# EasyEDA Pro project glimmer.epro, schematic Glimmer
Board Name: Glimmer; Create Date: 2026-05-20; Page Name: Glimmer; Project Name: glimmer; Schematic Name: Glimmer; Update Date: 2026-05-23; Company: EasyEDA.com; Page Size: A4; Version: V2.0.1
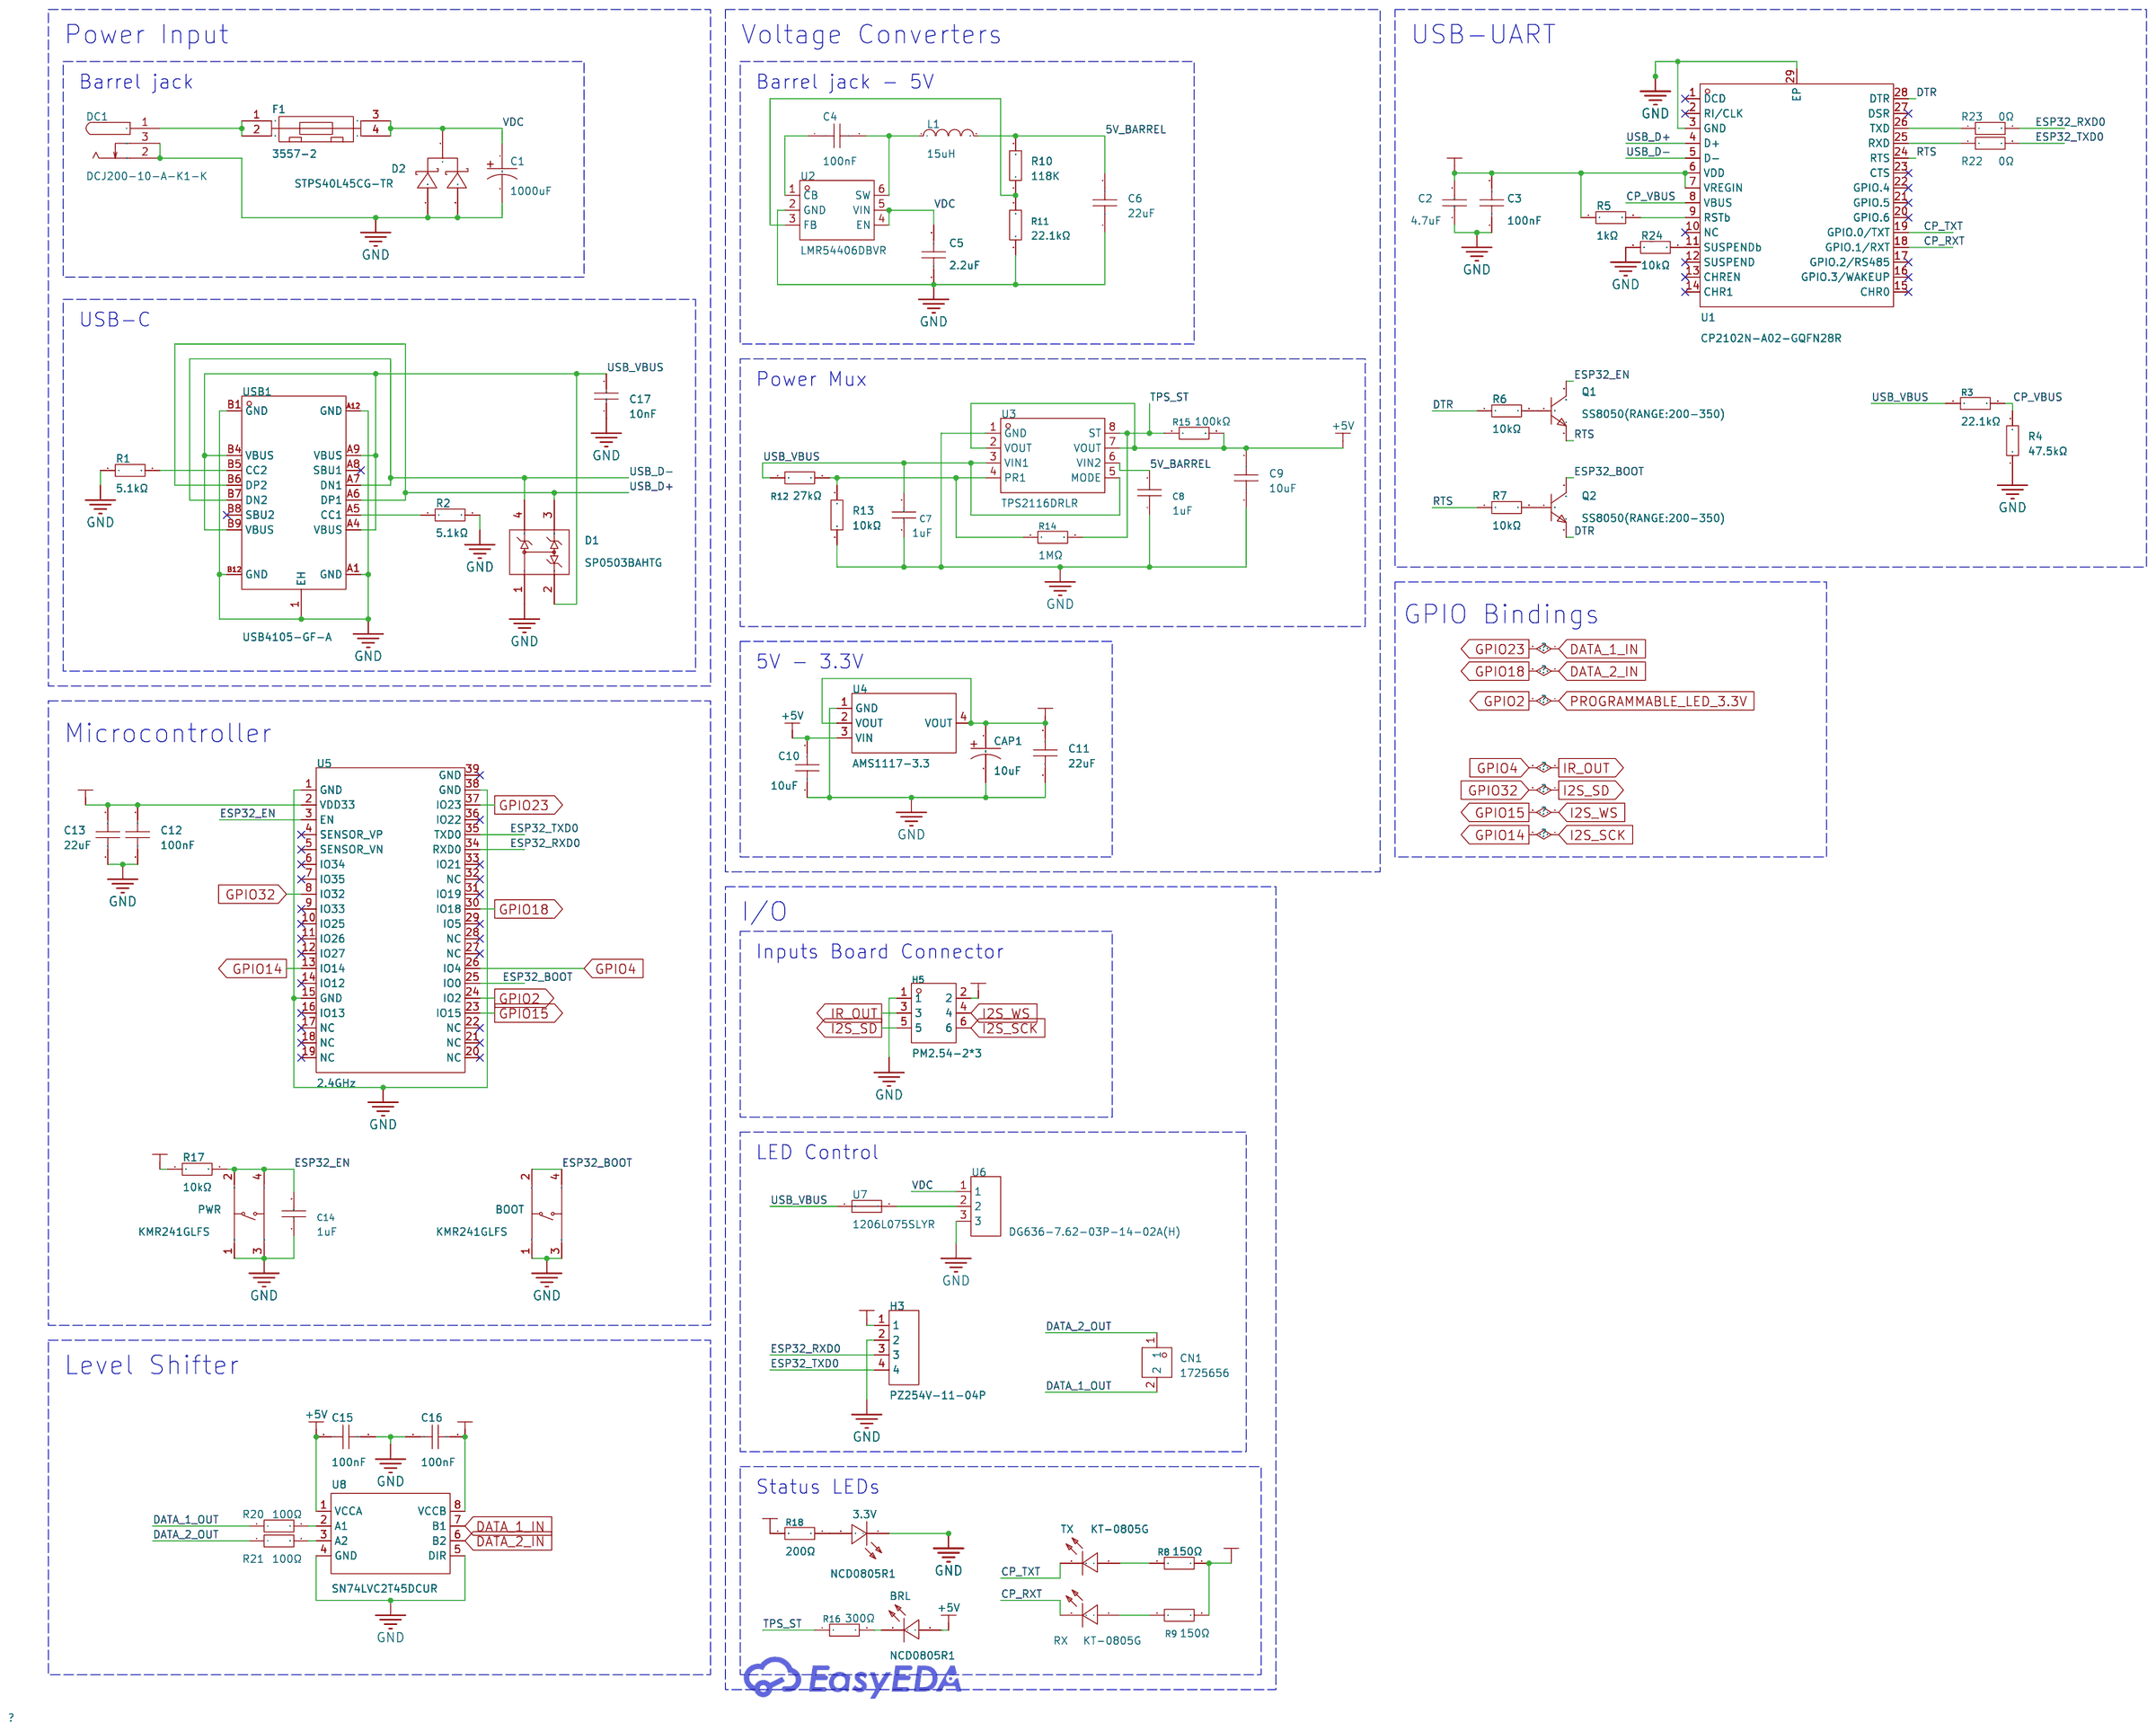
[diagram p0: schematic sheet]

## Parts
3.3V  NCD0805R1  [LED0805-RD]
BOOT  KMR241GLFS  [KEY-SMD_4P-L4.2-W2.8-P1.60-LS4.6]
BRL  NCD0805R1  [LED0805-RD]
C1  1000uF  [CAP-TH_BD18.0-P7.50-D1.2-FD]
C2  4.7uF  [C0805]
C3  100nF  [C0805]
C4  100nF  [C0805]
C5  2.2uF  [C0805]
C6  22uF  [C0805]
C7  1uF  [C0805]
C8  1uF  [C0805]
C9  10uF  [C0805]
C10  10uF  [C0805]
C11  22uF  [C0805]
C12  100nF  [C0805]
C13  22uF  [C0805]
C14  1uF  [C0805]
C15  100nF  [C0805]
C16  100nF  [C0805]
C17  10nF  [C0805]
CAP1  10uF  [CAP-SMD_L2.0-W1.3-FD]
CN1  1725656  [CONN-TH_2P-P2.54_1725656]
D1  SP0503BAHTG  [SOT-143_L2.9-W1.3-P1.92-LS2.3-BR]
D2  STPS40L45CG-TR  [TO-263-2_L10.0-W9.1-P5.08-LS15.2-BR]
DC1  DCJ200-10-A-K1-K  [DC-IN-TH_DCJ200-10-A-K1-K]
F1  3557-2  [FUSE-TH_4P-L19.8-W6.7_3557-2]
H3  PZ254V-11-04P  [HDR-TH_4P-P2.54-V-M]
H5  PM2.54-2*3  [HDR-TH_6P-P2.54-V-F-R2-C3-S2.54]
L1  15uH  [IND-SMD_L3.0-W3.0_FNR3010S]
PWR  KMR241GLFS  [KEY-SMD_4P-L4.2-W2.8-P1.60-LS4.6]
Q1  SS8050(RANGE:200-350)  [SOT-23-3_L2.9-W1.3-P1.90-LS2.4-BR]
Q2  SS8050(RANGE:200-350)  [SOT-23-3_L2.9-W1.3-P1.90-LS2.4-BR]
R1  5.1kΩ  [R0805]
R2  5.1kΩ  [R0805]
R3  22.1kΩ  [R0805]
R4  47.5kΩ  [R0805]
R5  1kΩ  [R0805]
R6  10kΩ  [R0805]
R7  10kΩ  [R0805]
R8  150Ω  [R0805]
R9  150Ω  [R0805]
R10  118K  [R0805]
R11  22.1kΩ  [R0805]
R12  27kΩ  [R0805]
R13  10kΩ  [R0805]
R14  1MΩ  [R0805]
R15  100kΩ  [R0805]
R16  300Ω  [R0805]
R17  10kΩ  [R0805]
R18  200Ω  [R0805]
R20  100Ω  [R0805]
R21  100Ω  [R0805]
R22  0Ω  [R0805]
R23  0Ω  [R0805]
R24  10kΩ  [R0805]  (no BOM)
RX  KT-0805G  [LED0805-R-RD]
TX  KT-0805G  [LED0805-R-RD]
U1  CP2102N-A02-GQFN28R  [QFN-28_L5.0-W5.0-P0.50-TL-EP3.3]
U2  LMR54406DBVR  [SOT-23-6_L2.9-W1.6-P0.95-LS2.8-BR]
U3  TPS2116DRLR  [SOT-583-8_L2.1-W1.6-P0.50-LS1.6-BL]
U4  AMS1117-3.3  [SOT-223-3_L6.5-W3.4-P2.30-LS7.0-BR]
U5  2.4GHz  [WIFIM-SMD_39P-L31.4-W18.0-P1.27-1]
U6  DG636-7.62-03P-14-02A(H)  [CONN-TH_DG636-7.62-03P-14-02A-H]
U7  1206L075SLYR  [R1206]
U8  SN74LVC2T45DCUR  [VSSOP-8_L2.4-W2.1-P0.50-LS3.2-BR]
USB1  USB4105-GF-A  [TYPE-C-SMD_SBC-160S1A-20-S412]

## Library data of the parts
3.3V BRL = NCD0805R1_C84256: Lamp Holder Type:- Illumination Color:Red Voltage - Forward(Vf):1.6V~2.6V Voltage - Forward(Vf):1.6V~2.6V Power(Watts):65mW Forward Current:25mA Wavelength - Dominant:615nm~630nm Wavelength - Dominant:615nm~630nm Peak Wavelength:630nm Diode Configuration:; LCSC Part Name: 片式发光二极管; Supplier Part: C84256; Manufacturer: 国星光电; Supplier Footprint: 0805; JLCPCB Part Class: Basic Part; Datasheet: https://item.szlcsc.com/datasheet/NCD0805R1/85425.html; Supplier: LCSC; Illumination Color: Red; Voltage - Forward(Vf): 1.6V~2.6V; Power(Watts): 65mW; Forward Current: 25mA; Wavelength - Dominant: 615nm~630nm; Peak Wavelength: 630nm; Diode Configuration: Discrete Diode; Luminous Intensity: 195mcd; Viewing Angle: 130°; Operating Temperature: -30℃~+85℃
BOOT PWR = KMR241GLFS: Circuit:SPST-NO Actuator Style:Round Button Operating Force:4N Mounting Type:Surface Mount,Vertical Contact Current:50mA Voltage Rating:32V Termination Style:Gull Wing Operating Temperature:-40℃~+85℃ Operating Temperature:-40℃~+85℃; LCSC Part Name: 轻触开关 Tactile Switch; Supplier Part: C221682; Manufacturer: C&K; Supplier Footprint: SMD; JLCPCB Part Class: Extended Part; Datasheet: https://item.szlcsc.com/datasheet/KMR241GLFS/222112.html; Supplier: LCSC; Circuit: SPST-NO; Actuator Style: Round Button; Operating Force: 4N; Mounting Type: Surface Mount,Vertical; Contact Current: 50mA; Voltage Rating: 32V; Termination Style: Gull Wing; Operating Temperature: -40℃~+85℃
C1 = LKMJ2001H102MF: Capacitance:1000uF Tolerance:±20% Tolerance:±20% Voltage Rating:50V Ripple Current:- Equivalent Series Resistance(ESR):- Pin Spacing:7.5mm Diameter:18mm Height - Seated (Max):20mm Lifetime:10000hrs@105℃; LCSC Part Name: 1000uF ±20% 50V; Supplier Part: C443025; Manufacturer: Ymin(永铭); Supplier Footprint: 插件,D18xL20mm; JLCPCB Part Class: Extended Part; Supplier: LCSC; Tolerance: ±20%; Voltage Rating: 50V; Pin Spacing: 7.5mm; Diameter: 18mm; Height - Seated (Max): 20mm; Lifetime: 10000hrs@105℃
C2 = CL21A475KAQNNNE: Capacitance:4.7uF Tolerance:±10% Tolerance:±10% Voltage Rating:25V Temperature Coefficient:X5R; LCSC Part Name: 4.7uF ±10% 25V; Supplier Part: C1779; Manufacturer: SAMSUNG(三星); Supplier Footprint: 0805; JLCPCB Part Class: Basic Part; Datasheet: https://item.szlcsc.com/datasheet/CL21A475KAQNNNE/2131.html; Supplier: LCSC; Tolerance: ±10%; Voltage Rating: 25V; Temperature Coefficient: X5R
C3 C4 C12 C15 C16 = CC0805KRX7R9BB104: Capacitance:100nF Tolerance:±10% Tolerance:±10% Voltage Rating:50V Temperature Coefficient:X7R; LCSC Part Name: 100nF ±10% 50V; Supplier Part: C49678; Manufacturer: YAGEO(国巨); Supplier Footprint: 0805; JLCPCB Part Class: Basic Part; Datasheet: https://item.szlcsc.com/datasheet/CC0805KRX7R9BB104/50686.html; Supplier: LCSC; Tolerance: ±10%; Voltage Rating: 50V; Temperature Coefficient: X7R
C5 = CL21A225KBQNNNE: Capacitance:2.2uF Tolerance:±10% Tolerance:±10% Voltage Rating:50V Temperature Coefficient:X5R; LCSC Part Name: 2.2uF ±10% 50V; Supplier Part: C377773; Manufacturer: SAMSUNG(三星); Supplier Footprint: 0805; JLCPCB Part Class: Basic Part; Datasheet: https://item.szlcsc.com/datasheet/CL21A225KBQNNNE/350246.html; Supplier: LCSC; Tolerance: ±10%; Voltage Rating: 50V; Temperature Coefficient: X5R
C6 = CGA0805X7R226M100MT: Capacitance:22uF Tolerance:±20% Tolerance:±20% Voltage Rating:10V Temperature Coefficient:X7R; LCSC Part Name: 22uF ±20% 10V; Supplier Part: C23692981; Manufacturer: HRE(芯声); Supplier Footprint: 0805; JLCPCB Part Class: Extended Part; Datasheet: https://item.szlcsc.com/datasheet/CGA0805X7R226M100MT/25421453.html; Supplier: LCSC; Tolerance: ±20%; Voltage Rating: 10V; Temperature Coefficient: X7R
C7 C8 C14 = CL21B105KBFNNNE: Capacitance:1uF Tolerance:±10% Tolerance:±10% Voltage Rating:50V Temperature Coefficient:X7R; LCSC Part Name: 1uF ±10% 50V; Supplier Part: C28323; Manufacturer: SAMSUNG(三星); Supplier Footprint: 0805; JLCPCB Part Class: Basic Part; Datasheet: https://item.szlcsc.com/datasheet/CL21B105KBFNNNE/29074.html; Supplier: LCSC; Tolerance: ±10%; Voltage Rating: 50V; Temperature Coefficient: X7R
C9 C10 = CL21A106KAYNNNE_C15850: Capacitance:10uF Tolerance:±10% Tolerance:±10% Voltage Rating:25V Temperature Coefficient:X5R; LCSC Part Name: 10uF ±10% 25V; Supplier Part: C15850; Manufacturer: SAMSUNG(三星); Manufacturer Part: CL21A106KAYNNNE; Supplier Footprint: 0805; JLCPCB Part Class: Basic Part; Datasheet: https://item.szlcsc.com/datasheet/CL21A106KAYNNNE/16532.html; Supplier: LCSC; Tolerance: ±10%; Voltage Rating: 25V; Temperature Coefficient: X5R
C11 C13 = CL21A226MAQNNNE: Capacitance:22uF Tolerance:±20% Tolerance:±20% Voltage Rating:25V Temperature Coefficient:X5R; LCSC Part Name: 22uF ±20% 25V; Supplier Part: C45783; Manufacturer: SAMSUNG(三星); Supplier Footprint: 0805; JLCPCB Part Class: Basic Part; Datasheet: https://item.szlcsc.com/datasheet/CL21A226MAQNNNE/46786.html; Supplier: LCSC; Tolerance: ±20%; Voltage Rating: 25V; Temperature Coefficient: X5R
C17 = CL21B103KBANNNC: Capacitance:10nF Tolerance:±10% Tolerance:±10% Voltage Rating:50V Temperature Coefficient:X7R; LCSC Part Name: 10nF ±10% 50V; Supplier Part: C1710; Manufacturer: SAMSUNG(三星); Supplier Footprint: 0805; JLCPCB Part Class: Basic Part; Datasheet: https://item.szlcsc.com/datasheet/CL21B103KBANNNC/2062.html; Supplier: LCSC; Tolerance: ±10%; Voltage Rating: 50V; Temperature Coefficient: X7R
CAP1 = CA45-P-10V-10uF-K: Capacitance:10uF Tolerance:±10% Tolerance:±10% Voltage Rating:10V Current - Leakage:1uA Ripple Current:- Equivalent Series Resistance(ESR):- Operating Temperature:-55℃~+125℃ Operating Temperature:-55℃~+125℃; LCSC Part Name: 10uF ±10% 10V; Supplier Part: C879894; Manufacturer: CEC(振华新云); Supplier Footprint: CASE-P-2012-12(mm); JLCPCB Part Class: Extended Part; Datasheet: https://item.szlcsc.com/datasheet/CA45-P-10V-10uF-K/940979.html; Supplier: LCSC; Tolerance: ±10%; Voltage Rating: 10V; Current - Leakage: 1uA; Operating Temperature: -55℃~+125℃
CN1 = 1725656: Pitch:2.54mm Color:Green Mounting Type:Through Hole Number of Pins:2P Number of Rows:1 Number of PINs Per Row:2 Current Rating:6A Voltage Rating (Max):125V; LCSC Part Name: 2.54mm 排数:1 每排P数:2 直插; Supplier Part: C3029316; Manufacturer: Phoenix Contact(菲尼克斯); Supplier Footprint: 插件,P=2.54mm; JLCPCB Part Class: Extended Part; Datasheet: https://item.szlcsc.com/datasheet/1725656/3561221.html; Supplier: LCSC; Pitch: 2.54mm; Color: Green; Mounting Type: Through Hole; Number of Pins: 2P; Number of Rows: 1; Number of PINs Per Row: 2; Current Rating: 6A; Voltage Rating (Max): 125V
D1 = SP0503BAHTG_C7074: Reverse Stand-Off Voltage (Vrwm):5.5V Clamping Voltage:8.5V Reverse Leakage Current (Ir):100nA Number of Channels:3.0 Operating Temperature:-55℃~+125℃ Operating Temperature:-55℃~+125℃ level of protection:IEC 61000-4-2 Type:TVS Junction Capacitance:30pF; LCSC Part Name: TVS 5.5V截止; Supplier Part: C7074; Manufacturer: Littelfuse(美国力特); Supplier Footprint: SOT-143; JLCPCB Part Class: Extended Part; Datasheet: https://item.szlcsc.com/datasheet/SP0503BAHTG/7546.html; Supplier: LCSC; Reverse Stand-Off Voltage (Vrwm): 5.5V; Clamping Voltage: 8.5V; Reverse Leakage Current (Ir): 100nA; Number of Channels: 3; Operating Temperature: -55℃~+125℃; level of protection: IEC 61000-4-2; Type: TVS; Junction Capacitance: 30pF
D2 = STPS40L45CG-TR: Diode Configuration:1 Pair Common Cathode Voltage - Forward(Vf@If):530mV@20A Voltage - DC Reverse(Vr):45V Current - Rectified:20A Reverse Leakage Current (Ir):600uA@45V Non-Repetitive Peak Forward Surge Current:220A; LCSC Part Name: 电压:45V 电流:20A; Supplier Part: C213442; Manufacturer: ST(意法半导体); Supplier Footprint: TO-263-2; JLCPCB Part Class: Extended Part; Datasheet: https://item.szlcsc.com/datasheet/STPS40L45CG-TR/214349.html; Supplier: LCSC; Diode Configuration: 1 Pair Common Cathode; Voltage - Forward(Vf@If): 530mV@20A; Voltage - DC Reverse(Vr): 45V; Current - Rectified: 20A; Reverse Leakage Current (Ir): 600uA@45V; Non-Repetitive Peak Forward Surge Current: 220A
DC1 = DCJ200-10-A-K1-K: Connector Type:DC Power Jack Mounting Type:Right Angle Inside Contact Diameter:2mm Outside Contact Diameter:6.3mm Current Rating:5A Voltage Rating (Max):20V Operating Temperature:-20℃~+70℃ Operating Temperature:-20℃~+70℃; LCSC Part Name: DC电源插座 内径:2mm 外径:6.3mm; Supplier Part: C5280493; Manufacturer: GCT; Supplier Footprint: 插件; JLCPCB Part Class: Extended Part; Datasheet: https://item.szlcsc.com/datasheet/DCJ200-10-A-K1-K/6016285.html; Supplier: LCSC; Connector Type: DC Power Jack; Mounting Type: Right Angle; Inside Contact Diameter: 2mm; Outside Contact Diameter: 6.3mm; Current Rating: 5A; Voltage Rating (Max): 20V; Operating Temperature: -20℃~+70℃
F1 = 3557-2: Fuseholder Type:Bracket type Number of Circuits:1 Voltage Rating:500V Current Rating:30A Fuse Type:Blade; LCSC Part Name: 30A 500V 支座型; Supplier Part: C352820; Manufacturer: Keystone; JLCPCB Part Class: Extended Part; Datasheet: https://item.szlcsc.com/datasheet/3557-2/328627.html; Supplier: LCSC; Fuseholder Type: Bracket type; Number of Circuits: 1; Voltage Rating: 500V; Current Rating: 30A; Fuse Type: Blade
H3 = PZ254V-11-04P_C492403: Pin Structure:1x4P Pitch:2.54mm Row Spacing:- Circluar Pins/Square Pins:Pin Header Mounting Type:Through Hole Number of Rows:1 Number of Pins:4P Current Rating:3A Voltage Rating (Max):250V Length of Mating Pin:6mm Insulation Height:2.5mm Length of End Con; LCSC Part Name: 1x4P 间距:2.54mm 方针 直插; Supplier Part: C492403; Manufacturer: XFCN(兴飞); Supplier Footprint: 插件,P=2.54mm; JLCPCB Part Class: Extended Part; Datasheet: https://item.szlcsc.com/datasheet/PZ254V-11-04P/502959.html; Supplier: LCSC; Pin Structure: 1x4P; Pitch: 2.54mm; Circluar Pins/Square Pins: Pin Header; Mounting Type: Through Hole; Number of Rows: 1; Number of Pins: 4P; Current Rating: 3A; Voltage Rating (Max): 250V; Length of Mating Pin: 6mm; Insulation Height: 2.5mm; Length of End Connection Pin: 3mm; Contact Material: Brass; Operating Temperature: -40℃~+105℃; Color: Black
H5 = PM2.54-2*3: Holes Structure:2x3P Pitch:2.54mm Row Spacing:2.54mm Circular Hole / Square Hole:Square Hole Mounting Type:Through Hole Number of Rows:2 Number of Positions:6P Current Rating:2.5A Holes Direction:Top Insulation Height:8.5mm Operating Temperature:-40℃~+105; LCSC Part Name: 间距:2.54mm 2x3P 直插; Supplier Part: C5116527; Manufacturer: ZHOURI(洲日); Supplier Footprint: 插件,P=2.54mm; JLCPCB Part Class: Extended Part; Datasheet: https://item.szlcsc.com/datasheet/PM2.54-2*3/5692944.html; Supplier: LCSC; Holes Structure: 2x3P; Pitch: 2.54mm; Row Spacing: 2.54mm; Circular Hole / Square Hole: Square Hole; Mounting Type: Through Hole; Number of Rows: 2; Number of Positions: 6P; Current Rating: 2.5A; Holes Direction: Top; Insulation Height: 8.5mm; Operating Temperature: -40℃~+105℃
L1 = FNR3015S150MT: Inductance: Tolerance:±20% Tolerance:±20% Rated Current: Saturation Current (Isat):880mA DC Resistance (DCR):455mΩ; LCSC Part Name: 15uH ±20% 880mA; Supplier Part: C167759; Manufacturer: cjiang(长江微电); Supplier Footprint: SMD,3x3mm; JLCPCB Part Class: Extended Part; Datasheet: https://atta.szlcsc.com/upload/public/pdf/source/20190327/C167925_9EFF0AABC4CA629C2CC95961DBF7D39D.pdf; Supplier: LCSC; Tolerance: ±20%; Saturation Current (Isat): 880mA; DC Resistance (DCR): 455mΩ
Q1 Q2 = SS8050(RANGE:200-350)_C2150: type:NPN Current - Collector(Ic):1.5A Collector - Emitter Voltage VCEO:25V Pd - Power Dissipation:300mW DC Current Gain:200@800mA,1V DC Current Gain:200@800mA,1V Transition frequency(fT):100MHz Current - Collector Cutoff:100nA Vce Saturation(VCE(sat)):500; LCSC Part Name: hfe=200~350 NPN 电流:1.5A 电压:25V; Supplier Part: C2150; Manufacturer: CJ(江苏长电/长晶); Supplier Footprint: SOT-23; JLCPCB Part Class: Basic Part; Datasheet: https://item.szlcsc.com/datasheet/SS8050(RANGE%253A200-350)/2507.html; Supplier: LCSC; type: NPN; Current - Collector(Ic): 1.5A; Collector - Emitter Voltage VCEO: 25V; Pd - Power Dissipation: 300mW; DC Current Gain: 200@800mA,1V; Transition frequency(fT): 100MHz; Current - Collector Cutoff: 100nA; Vce Saturation(VCE(sat)): 500mV@800mA,80mA; Operating Temperature: -55℃~+150℃; Emitter-Base Voltage(Vebo): 5V; Number: 1 NPN
R1 R2 = 0805W8F5101T5E: Type:Thick Film Resistor Resistance:5.1kΩ Tolerance:±1% Tolerance:±1% Power(Watts):125mW Voltage-Supply(Max):150V Temperature Coefficient:±100ppm/℃ Temperature Coefficient:±100ppm/℃ Operating Temperature:-55℃~+155℃ Operating Temperature:-55℃~+155℃; LCSC Part Name: 5.1kΩ ±1% 125mW 厚膜电阻; Supplier Part: C27834; Manufacturer: UNI-ROYAL(厚声); Supplier Footprint: 0805; JLCPCB Part Class: Basic Part; Datasheet: https://item.szlcsc.com/datasheet/0805W8F5101T5E/28584.html; Supplier: LCSC; Type: Thick Film Resistor; Tolerance: ±1%; Power(Watts): 125mW; Voltage-Supply(Max): 150V; Temperature Coefficient: ±100ppm/℃; Operating Temperature: -55℃~+155℃
R3 R11 = 0805W8F2212T5E: Type:Thick Film Resistor Resistance:22.1kΩ Tolerance:±1% Tolerance:±1% Power(Watts):125mW Voltage-Supply(Max):150V Temperature Coefficient:±100ppm/℃ Temperature Coefficient:±100ppm/℃ Operating Temperature:-55℃~+155℃ Operating Temperature:-55℃~+155℃; LCSC Part Name: 22.1kΩ ±1% 125mW 厚膜电阻; Supplier Part: C17552; Manufacturer: UNI-ROYAL(厚声); Supplier Footprint: 0805; JLCPCB Part Class: Extended Part; Datasheet: https://item.szlcsc.com/datasheet/0805W8F2212T5E/18240.html; Supplier: LCSC; Type: Thick Film Resistor; Tolerance: ±1%; Power(Watts): 125mW; Voltage-Supply(Max): 150V; Temperature Coefficient: ±100ppm/℃; Operating Temperature: -55℃~+155℃
R4 = 0805W8F4752T5E: Type:Thick Film Resistor Resistance:47.5kΩ Tolerance:±1% Tolerance:±1% Power(Watts):125mW Voltage-Supply(Max):150V Temperature Coefficient:±100ppm/℃ Temperature Coefficient:±100ppm/℃ Operating Temperature:-55℃~+155℃ Operating Temperature:-55℃~+155℃; LCSC Part Name: 47.5kΩ ±1% 125mW 厚膜电阻; Supplier Part: C26011; Manufacturer: UNI-ROYAL(厚声); Supplier Footprint: 0805; JLCPCB Part Class: Extended Part; Datasheet: https://item.szlcsc.com/datasheet/0805W8F4752T5E/26754.html; Supplier: LCSC; Type: Thick Film Resistor; Tolerance: ±1%; Power(Watts): 125mW; Voltage-Supply(Max): 150V; Temperature Coefficient: ±100ppm/℃; Operating Temperature: -55℃~+155℃
R5 = 0805W8F1001T5E: Type:Thick Film Resistors Resistance:1kΩ Tolerance:±1% Tolerance:±1% Power(Watts): Overload Voltage (Max): Temperature Coefficient:±100ppm/℃ Temperature Coefficient:±100ppm/℃ Operating Temperature Range:-55℃~+155℃ Operating Temperature Range:-55℃~+155℃; LCSC Part Name: 1kΩ ±1% 125mW 厚膜电阻; Supplier Part: C17513; Manufacturer: UNI-ROYAL(厚声); Supplier Footprint: 0805; JLCPCB Part Class: Basic Part; Datasheet: https://atta.szlcsc.com/upload/public/pdf/source/20200306/C422600_1E6D84923E4A46A82E41ADD87F860B5C.pdf; Supplier: LCSC; Type: Thick Film Resistors; Tolerance: ±1%; Temperature Coefficient: ±100ppm/℃; Operating Temperature Range: -55℃~+155℃
R6 R7 R13 R17 R24 = 0805W8F1002T5E: Type:Thick Film Resistor Resistance:10kΩ Tolerance:±1% Tolerance:±1% Power(Watts):125mW Voltage-Supply(Max):150V Temperature Coefficient:±100ppm/℃ Temperature Coefficient:±100ppm/℃ Operating Temperature:-55℃~+155℃ Operating Temperature:-55℃~+155℃; LCSC Part Name: 10kΩ ±1% 125mW 厚膜电阻; Supplier Part: C17414; Manufacturer: UNI-ROYAL(厚声); Supplier Footprint: 0805; JLCPCB Part Class: Basic Part; Datasheet: https://item.szlcsc.com/datasheet/0805W8F1002T5E/18102.html; Supplier: LCSC; Type: Thick Film Resistor; Tolerance: ±1%; Power(Watts): 125mW; Voltage-Supply(Max): 150V; Temperature Coefficient: ±100ppm/℃; Operating Temperature: -55℃~+155℃
R8 R9 = 0805W8F1500T5E: Type:Thick Film Resistor Resistance:150Ω Tolerance:±1% Tolerance:±1% Power(Watts):125mW Voltage-Supply(Max):150V Temperature Coefficient:±100ppm/℃ Temperature Coefficient:±100ppm/℃ Operating Temperature:-55℃~+155℃ Operating Temperature:-55℃~+155℃; LCSC Part Name: 150Ω ±1% 125mW 厚膜电阻; Supplier Part: C17471; Manufacturer: UNI-ROYAL(厚声); Supplier Footprint: 0805; JLCPCB Part Class: Basic Part; Datasheet: https://item.szlcsc.com/datasheet/0805W8F1500T5E/18159.html; Supplier: LCSC; Type: Thick Film Resistor; Tolerance: ±1%; Power(Watts): 125mW; Voltage-Supply(Max): 150V; Temperature Coefficient: ±100ppm/℃; Operating Temperature: -55℃~+155℃
R10 = Res_0603: Supplier Footprint: 0805; Supplier: LCSC; Supplier Part: C52209969
R12 = 0805W8F2702T5E: Type:Thick Film Resistor Resistance:27kΩ Tolerance:±1% Tolerance:±1% Power(Watts):125mW Voltage-Supply(Max):150V Temperature Coefficient:±100ppm/℃ Temperature Coefficient:±100ppm/℃ Operating Temperature:-55℃~+155℃ Operating Temperature:-55℃~+155℃; LCSC Part Name: 27kΩ ±1% 125mW 厚膜电阻; Supplier Part: C17593; Manufacturer: UNI-ROYAL(厚声); Supplier Footprint: 0805; JLCPCB Part Class: Basic Part; Datasheet: https://item.szlcsc.com/datasheet/0805W8F2702T5E/18281.html; Supplier: LCSC; Type: Thick Film Resistor; Tolerance: ±1%; Power(Watts): 125mW; Voltage-Supply(Max): 150V; Temperature Coefficient: ±100ppm/℃; Operating Temperature: -55℃~+155℃
R14 = 0805W8F1004T5E: Type:Thick Film Resistors Resistance:1MΩ Tolerance:±1% Tolerance:±1% Power(Watts): Overload Voltage (Max): Temperature Coefficient:±100ppm/℃ Temperature Coefficient:±100ppm/℃ Operating Temperature Range:-55℃~+155℃ Operating Temperature Range:-55℃~+155℃; LCSC Part Name: 1MΩ ±1% 125mW 厚膜电阻; Supplier Part: C17514; Manufacturer: UNI-ROYAL(厚声); Supplier Footprint: 0805; JLCPCB Part Class: Basic Part; Datasheet: https://atta.szlcsc.com/upload/public/pdf/source/20200306/C422600_1E6D84923E4A46A82E41ADD87F860B5C.pdf; Supplier: LCSC; Type: Thick Film Resistors; Tolerance: ±1%; Temperature Coefficient: ±100ppm/℃; Operating Temperature Range: -55℃~+155℃
R15 = 0805W8F1003T5E: Type:Thick Film Resistor Resistance:100kΩ Tolerance:±1% Tolerance:±1% Power(Watts):125mW Voltage-Supply(Max):150V Temperature Coefficient:±100ppm/℃ Temperature Coefficient:±100ppm/℃ Operating Temperature:-55℃~+155℃ Operating Temperature:-55℃~+155℃; LCSC Part Name: 100kΩ ±1% 125mW 厚膜电阻; Supplier Part: C149504; Manufacturer: UNI-ROYAL(厚声); Supplier Footprint: 0805; JLCPCB Part Class: Basic Part; Datasheet: https://item.szlcsc.com/datasheet/0805W8F1003T5E/160838.html; Supplier: LCSC; Type: Thick Film Resistor; Tolerance: ±1%; Power(Watts): 125mW; Voltage-Supply(Max): 150V; Temperature Coefficient: ±100ppm/℃; Operating Temperature: -55℃~+155℃
R16 = 0805W8F3000T5E: Type:Thick Film Resistor Resistance:300Ω Tolerance:±1% Tolerance:±1% Power(Watts):125mW Voltage-Supply(Max):150V Temperature Coefficient:±100ppm/℃ Temperature Coefficient:±100ppm/℃ Operating Temperature:-55℃~+155℃ Operating Temperature:-55℃~+155℃; LCSC Part Name: 300Ω ±1% 125mW 厚膜电阻; Supplier Part: C17617; Manufacturer: UNI-ROYAL(厚声); Supplier Footprint: 0805; JLCPCB Part Class: Basic Part; Datasheet: https://item.szlcsc.com/datasheet/0805W8F3000T5E/18305.html; Supplier: LCSC; Type: Thick Film Resistor; Tolerance: ±1%; Power(Watts): 125mW; Voltage-Supply(Max): 150V; Temperature Coefficient: ±100ppm/℃; Operating Temperature: -55℃~+155℃
R18 = 0805W8F2000T5E: Type:Thick Film Resistor Resistance:200Ω Tolerance:±1% Tolerance:±1% Power(Watts):125mW Voltage-Supply(Max):150V Temperature Coefficient:±100ppm/℃ Temperature Coefficient:±100ppm/℃ Operating Temperature:-55℃~+155℃ Operating Temperature:-55℃~+155℃; LCSC Part Name: 200Ω ±1% 125mW 厚膜电阻; Supplier Part: C17540; Manufacturer: UNI-ROYAL(厚声); Supplier Footprint: 0805; JLCPCB Part Class: Basic Part; Datasheet: https://item.szlcsc.com/datasheet/0805W8F2000T5E/18228.html; Supplier: LCSC; Type: Thick Film Resistor; Tolerance: ±1%; Power(Watts): 125mW; Voltage-Supply(Max): 150V; Temperature Coefficient: ±100ppm/℃; Operating Temperature: -55℃~+155℃
R20 R21 = 0805W8F1000T5E_C17408: Type:Thick Film Resistors Resistance: Tolerance:±1% Tolerance:±1% Power(Watts): Overload Voltage (Max): Temperature Coefficient:±100ppm/℃ Temperature Coefficient:±100ppm/℃ Operating Temperature Range:-55℃~+155℃ Operating Temperature Range:-55℃~+155℃; LCSC Part Name: 100Ω ±1% 125mW 厚膜电阻; Supplier Part: C17408; Manufacturer: UNI-ROYAL(厚声); Manufacturer Part: 0805W8F1000T5E; Supplier Footprint: 0805; JLCPCB Part Class: Basic Part; Datasheet: https://atta.szlcsc.com/upload/public/pdf/source/20200306/C422600_1E6D84923E4A46A82E41ADD87F860B5C.pdf; Supplier: LCSC; Type: Thick Film Resistors; Tolerance: ±1%; Temperature Coefficient: ±100ppm/℃; Operating Temperature Range: -55℃~+155℃
R22 R23 = 0805W8F0000T5E_C17477: Type:Thick Film Resistor Resistance:0Ω Tolerance:±1% Tolerance:±1% Power(Watts):125mW Voltage-Supply(Max):150V Temperature Coefficient:±800ppm/℃ Temperature Coefficient:±800ppm/℃ Operating Temperature:-55℃~+155℃ Operating Temperature:-55℃~+155℃; LCSC Part Name: 0Ω ±1% 125mW 厚膜电阻; Supplier Part: C17477; Manufacturer: UNI-ROYAL(厚声); Manufacturer Part: 0805W8F0000T5E; Supplier Footprint: 0805; JLCPCB Part Class: Basic Part; Datasheet: https://item.szlcsc.com/datasheet/0805W8F0000T5E/18165.html; Supplier: LCSC; Type: Thick Film Resistor; Tolerance: ±1%; Power(Watts): 125mW; Voltage-Supply(Max): 150V; Temperature Coefficient: ±800ppm/℃; Operating Temperature: -55℃~+155℃
RX TX = KT-0805G: Lamp Holder Type:- Illumination Color:Emerald Green Voltage - Forward(Vf):2.6V~3.1V Voltage - Forward(Vf):2.6V~3.1V Power(Watts):100mW Forward Current:5mA Wavelength - Dominant:513nm~528nm Wavelength - Dominant:513nm~528nm Peak Wavelength:525nm Diode Conf; LCSC Part Name: 0805 翠绿 高亮; Supplier Part: C2297; Manufacturer: KENTO; Supplier Footprint: 0805; JLCPCB Part Class: Basic Part; Datasheet: https://item.szlcsc.com/datasheet/KT-0805G/2670.html; Supplier: LCSC; Illumination Color: Emerald Green; Voltage - Forward(Vf): 2.6V~3.1V; Power(Watts): 100mW; Forward Current: 5mA; Wavelength - Dominant: 513nm~528nm; Peak Wavelength: 525nm; Diode Configuration: Discrete Diode; Lens Color: Water Clear; Luminous Intensity: 430mcd; Viewing Angle: 120°; Operating Temperature: -40℃~+85℃
U1 = CP2102N-A02-GQFN28R: Applications Function:USB to UART USB Protocol:USB 2.0 Voltage - Supply:3V~3.6V Voltage - Supply:3V~3.6V Operating Temperature:-40℃~+85℃@(Ta) Operating Temperature:-40℃~+85℃@(Ta) Current - Supply:9.5mA Quiescent Supply Current:1.3uA; LCSC Part Name: USB转UART桥接器; Supplier Part: C964632; Manufacturer: SKYWORKS/SILICON LABS(芯科); Supplier Footprint: QFN-28-EP(5x5); JLCPCB Part Class: Extended Part; Datasheet: https://item.szlcsc.com/datasheet/CP2102N-A02-GQFN28R/1049893.html; Supplier: LCSC; Applications Function: USB to UART; USB Protocol: USB 2.0; Voltage - Supply: 3V~3.6V; Operating Temperature: -40℃~+85℃@(Ta); Current - Supply: 9.5mA; Quiescent Supply Current: 1.3uA
U2 = LMR54406DBVR: Function:Buck Voltage - Supply:4V~36V Voltage - Supply:4V~36V Output Voltage:1V~28V Output Voltage:1V~28V Output Current:600mA Frequency - Switching:1.265MHz Frequency - Switching:1.265MHz Operating Temperature:-40℃~+125℃ Operating Temperature:-40℃~+125℃; LCSC Part Name: 4V至45V、0.6A/1A降压转换器; Supplier Part: C5219316; Manufacturer: TI(德州仪器); Supplier Footprint: SOT-23-6; JLCPCB Part Class: Extended Part; Datasheet: https://www.ti.com/cn/lit/gpn/lmr54410; Supplier: LCSC; Function: Buck; Voltage - Supply: 4V~36V; Output Voltage: 1V~28V; Output Current: 600mA; Frequency - Switching: 1.265MHz; Operating Temperature: -40℃~+125℃; Synchronous Rectifier: Yes; Number of Outputs: 1; Topology: Buck; Quiescent Current: 80uA; Switch tube (built-in/external): Built-in; Output Type: Adjustable
U3 = TPS2116DRLR: LCSC Part Name: 具有手动和优先级切换功能的1.6V至5.5V、2.5A低IQ电源多路复用器; Supplier Part: C3235557; Manufacturer: TI(德州仪器); Supplier Footprint: SOT-583; JLCPCB Part Class: Extended Part; Datasheet: https://www.ti.com/cn/lit/gpn/tps2116; Supplier: LCSC
U4 = AMS1117-3.3_C6186: Output Type:Fixed Voltage - Supply:15V Output Voltage:3.3V Output Voltage:3.3V Output Current:1A Power Supply Rejection Ratio (PSRR):72dB@(120Hz) Voltage Dropout:1.1V@(800mA) standby current:5mA Noise:0.003%Vout Features:Over Current Protection；Thermal Sh; LCSC Part Name: 3.3V 1A 15V; Supplier Part: C6186; Manufacturer: AMS; Supplier Footprint: SOT-223; JLCPCB Part Class: Basic Part; Datasheet: https://item.szlcsc.com/datasheet/AMS1117-3.3/6652.html; Supplier: LCSC; Output Type: Fixed; Voltage - Supply: 15V; Output Voltage: 3.3V; Output Current: 1A; Power Supply Rejection Ratio (PSRR): 72dB@(120Hz); Voltage Dropout: 1.1V@(800mA); standby current: 5mA; Noise: 0.003%Vout; Features: Over Current Protection；Thermal Shutdown; Operating Temperature: -40℃~+125℃; Output Configuration: Positive; Number of Outputs: 1
U5 = ESP32-WROVER-E-N16R8: Wireless Standard:Bluetooth4.2 Interface Type:I2C；GPIO；UART；SPI；SDIO；ADC；I2S Frequency:2.4GHz Antenna Type:On-board PCB Antenna Output Power:20.5dBm Output Power:20.5dBm Voltage - Supply:3V~3.6V Voltage - Supply:3V~3.6V Receive  Current:108mA Send  Curren; LCSC Part Name: 不带固件 通用型Wi-Fi+BT+BLE MCU模组; Supplier Part: C529589; Manufacturer: ESPRESSIF(乐鑫); Supplier Footprint: SMD,31.4x18mm; JLCPCB Part Class: Extended Part; Datasheet: https://item.szlcsc.com/datasheet/ESP32-WROVER-E-N16R8/549855.html; Supplier: LCSC; Wireless Standard: Bluetooth4.2; Interface Type: I2C；GPIO；UART；SPI；SDIO；ADC；I2S; Antenna Type: On-board PCB Antenna; Output Power: 20.5dBm; Voltage - Supply: 3V~3.6V; Receive  Current: 108mA; Send  Current: 350mA; Sensitivity: -97dBm; Operating Temperature: -40℃~+85℃
U6 = DG636-7.62-03P-14-02A(H): Number of Positions or Pins:1x3P Pitch:7.62mm Color:- Mounting Type:Through Hole Number of Pins:3P Number of Rows:1 Number of PINs Per Row:3 Current Rating:32A Voltage Rating (Max):630V Wire Gauge - AWG:10~26 Operating Temperature:-40℃~+105℃ Operating Tem; LCSC Part Name: 1x3P 7.62mm 直插 排数:1 每排P数:3; Supplier Part: C2827898; Manufacturer: DEGSON(高正/高松); Supplier Footprint: 插件,P=7.62mm; JLCPCB Part Class: Extended Part; Datasheet: https://item.szlcsc.com/datasheet/DG636-7.62-03P-14-02A(H)/2974925.html; Supplier: LCSC; Number of Positions or Pins: 1x3P; Pitch: 7.62mm; Mounting Type: Through Hole; Number of Pins: 3P; Number of Rows: 1; Number of PINs Per Row: 3; Current Rating: 32A; Voltage Rating (Max): 630V; Wire Gauge - AWG: 10~26; Operating Temperature: -40℃~+105℃; Comment: might be too big
U7 = 1206L075SLYR: Voltage - Max:6V Current - Max:50A Hold Current:750mA Trip Current:1.5A Power Dissipation:800mW Resistance - Initial (Ri) (Min):17mΩ Resistance - Post Trip (R1) (Max):180mΩ Time to Trip(Max):300ms Operating Temperature:-40℃~+85℃ Operating Temperature:-40℃; LCSC Part Name: 6V 750mA 1206自恢复; Supplier Part: C315894; Manufacturer: Littelfuse(美国力特); Supplier Footprint: 1206; JLCPCB Part Class: Extended Part; Datasheet: https://item.szlcsc.com/datasheet/1206L075SLYR/297529.html; Supplier: LCSC; Voltage - Max: 6V; Current - Max: 50A; Hold Current: 750mA; Trip Current: 1.5A; Power Dissipation: 800mW; Resistance - Initial (Ri) (Min): 17mΩ; Resistance - Post Trip (R1) (Max): 180mΩ; Time to Trip(Max): 300ms; Operating Temperature: -40℃~+85℃
U8 = SN74LVC2T45DCUR: Input type:- output type:Tri-State Voltage - Supply:1.65V~5.5V Voltage - Supply:1.65V~5.5V Number of Elements:2 Number of Bits per Element:2 Channel Type:Bidirectional Current - Output Low(IOL):32mA Current - Output High(IOH):32mA Logic Family:74LVC Opera; LCSC Part Name: 双位双电源总线收发器，带可配置电压转换和三态输出; Supplier Part: C15741; Manufacturer: TI(德州仪器); Supplier Footprint: VSSOP-8; JLCPCB Part Class: Extended Part; Datasheet: https://www.ti.com/cn/lit/gpn/sn74lvc2t45; Supplier: LCSC; output type: Tri-State; Voltage - Supply: 1.65V~5.5V; Number of Elements: 2; Number of Bits per Element: 2; Channel Type: Bidirectional; Current - Output Low(IOL): 32mA; Current - Output High(IOH): 32mA; Logic Family: 74LVC; Operating Temperature: -40℃~+85℃; Quiescent Current: 10uA
USB1 = USB4105-GF-A: Connector Type:Type-C Protocol Standard:USB 2.0 Gender:Female Mounting Type:Surface Mount, Right Angle Number of Contacts:12P Number of Ports:1 Current Rating-Power:5A Voltage Rating:48V Detection color:Black Operating Temperature:-40℃~+85℃ Operating Temp; LCSC Part Name: Type-C 母 卧贴; Supplier Part: C3020560; Manufacturer: GCT; Supplier Footprint: SMD; JLCPCB Part Class: Extended Part; Datasheet: https://item.szlcsc.com/datasheet/USB4105-GF-A/3542626.html; Supplier: LCSC; Connector Type: Type-C; Protocol Standard: USB 2.0; Gender: Female; Mounting Type: Surface Mount, Right Angle; Number of Contacts: 12P; Number of Ports: 1; Current Rating-Power: 5A; Voltage Rating: 48V; Detection color: Black; Operating Temperature: -40℃~+85℃

## Nets
3.3V: C2.2 C3.2 C11.2 C12.2 C13.2 C16.2 CAP1.1 H3.1 H5.2 R5.1 R8.2 R9.2 R17.1 R18.1 U1.6(VDD) U1.7(VREGIN) U4.2(VOUT) U4.4(VOUT) U5.2(VDD33) U8.8(VCCB)
5V_BARREL: C6.2 C8.2 L1.2 R10.2 U3.6(VIN2)
+5V: BRL.2(+) C9.2 C10.2 C15.1 R15.2 U3.2(VOUT) U3.7(VOUT) U4.3(VIN) U8.1(VCCA)
GND: 3.3V.1(-) BOOT.1 BOOT.3 C1.2 C2.1 C3.1 C5.1 C6.1 C7.1 C8.1 C9.1 C10.1 C11.1 C12.1 C13.1 C14.1 C15.2 C16.1 C17.1 CAP1.2 D1.1 D2.1 D2.3 DC1.2 DC1.3 H3.2 H5.1 PWR.1 PWR.3 R1.1 R2.2 R4.1 R11.1 R13.1 R24.1 U1.3(GND) U1.29(EP) U2.2(GND) U3.1(GND) U4.1(GND) U5.1(GND) U5.15(GND) U5.38(GND) U6.3 U8.4(GND) U8.5(DIR) USB1.1(EH) USB1.A1(GND) USB1.A12(GND) USB1.B1(GND) USB1.B12(GND)
CP_RXT: RX.2(K) U1.18(GPIO.1/RXT)
CP_TXT: TX.2(K) U1.19(GPIO.0/TXT)
CP_VBUS: R3.2 R4.2 U1.8(VBUS)
DATA_1_IN: U5.37(IO23) U8.7(B1)
DATA_1_OUT: CN1.2 R20.1
DATA_2_IN: U5.30(IO18) U8.6(B2)
DATA_2_OUT: CN1.1 R21.1
DTR: Q2.2(E) R6.1 U1.28(DTR)
ESP32_BOOT: BOOT.2 BOOT.4 Q2.3(C) U5.25(IO0)
ESP32_EN: C14.2 PWR.2 PWR.4 Q1.3(C) R17.2 U5.3(EN)
ESP32_RXD0: H3.3 R23.2 U5.34(RXD0)
ESP32_TXD0: H3.4 R22.2 U5.35(TXD0)
GPIO2: U5.24(IO2)
GPIO4: H5.3 U5.26(IO4)
GPIO14: H5.6 U5.13(IO14)
GPIO15: H5.4 U5.23(IO15)
GPIO32: H5.5 U5.8(IO32)
RTS: Q1.2(E) R7.1 U1.24(RTS)
TPS_ST: R14.2 R15.1 R16.1 U3.8(ST)
USB_D+: D1.3 U1.4(D+) USB1.A6(DP1) USB1.B6(DP2)
USB_D-: D1.4 U1.5(D-) USB1.A7(DN1) USB1.B7(DN2)
USB_VBUS: C7.2 C17.2 D1.2 R3.1 R12.1 U3.3(VIN1) U3.5(MODE) U7.1 USB1.A4(VBUS) USB1.A9(VBUS) USB1.B4(VBUS) USB1.B9(VBUS)
VDC: C1.1 C5.2 D2.4(K) F1.3 F1.4 U2.4(EN) U2.5(VIN) U6.1
$1N1261: DC1.1 F1.1 F1.2
$1N1267: R1.2 USB1.B5(CC2)
$1N1268: R2.1 USB1.A5(CC1)
$1N2130: R5.2 U1.9(RSTb)
$1N2140: Q2.1(B) R7.2
$1N2141: Q1.1(B) R6.2
$1N2159: R23.1 U1.26(TXD)
$1N2160: R22.1 U1.25(RXD)
$1N2165: R24.2 U1.11(SUSPENDb)
$1N3037: R10.1 R11.2 U2.3(FB)
$1N3040: C4.2 L1.1 U2.6(SW)
$1N3041: C4.1 U2.1(CB)
$1N3045: R12.2 R13.2 R14.1 U3.4(PR1)
$1N3047: BRL.1(-) R16.2
$1N3995: 3.3V.2(+) R18.2
$1N4000: U6.2 U7.2
$1N4313: R20.2 U8.2(A1)
$1N4314: R21.2 U8.3(A2)
$1N4682: R9.1 RX.1(A)
$1N4683: R8.1 TX.1(A)

Not connected (* = marked no-connect by the designer): U1 1(DCD)* 2(RI/CLK)* 10(NC)* 12(SUSPEND)* 13(CHREN)* 14(CHR1)* 15(CHR0)* 16(GPIO.3/WAKEUP)* 17(GPIO.2/RS485)* 20(GPIO.6)* 21(GPIO.5)* 22(GPIO.4)* 23(CTS)* 27(DSR)*; U5 4(SENSOR_VP)* 5(SENSOR_VN)* 6(IO34)* 7(IO35)* 9(IO33)* 10(IO25)* 11(IO26)* 12(IO27)* 14(IO12)* 16(IO13)* 17(NC)* 18(NC)* 19(NC)* 20(NC)* 21(NC)* 22(NC)* 27(NC)* 28(NC)* 29(IO5)* 31(IO19)* 32(NC)* 33(IO21)* 36(IO22)* 39(GND)*; USB1 A8(SBU1)* B8(SBU2)*

## Notes on the sheet
- Power Input
- Voltage Converters
- USB-UART
- Barrel jack
- Barrel jack - 5V
- USB-C
- Power Mux
- GPIO Bindings
- 5V - 3.3V
- Microcontroller
- I/O
- Inputs Board Connector
- LED Control
- Level Shifter
- Status LEDs
